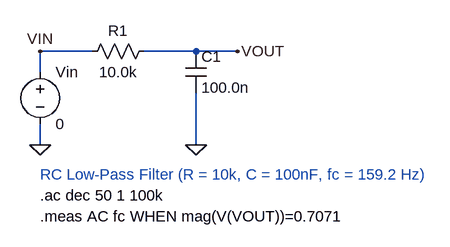
[diagram p0: schematic rc_filter.asc]
rc_filter.asc, the LTspice schematic file:
Version 4
SHEET 1 880 680
WIRE 80 160 80 192
WIRE 80 160 160 160
WIRE 80 272 80 304
WIRE 240 160 320 160
WIRE 320 160 384 160
WIRE 320 224 320 304
FLAG 80 160 VIN
FLAG 80 304 0
FLAG 384 160 VOUT
FLAG 320 304 0
SYMBOL voltage 80 176 R0
WINDOW 0 24 16 Left 2
WINDOW 3 24 96 Left 2
SYMATTR InstName Vin
SYMATTR Value 0
SYMATTR Value2 AC 1.0
SYMBOL res 256 144 R90
WINDOW 0 0 56 VBottom 2
WINDOW 3 32 56 VTop 2
SYMATTR InstName R1
SYMATTR Value 10.0k
SYMBOL cap 304 160 R0
SYMATTR InstName C1
SYMATTR Value 100.0n
TEXT 80 350 Left 2 ;RC Low-Pass Filter (R = 10k, C = 100nF, fc = 159.2 Hz)
TEXT 80 382 Left 2 !.ac dec 50 1 100k
TEXT 80 414 Left 2 !.meas AC fc WHEN mag(V(VOUT))=0.7071

The netlist it stands for:
* rc_filter.asc
Vin VIN 0 0 AC 1.0
R1 VOUT VIN 10.0k
C1 VOUT 0 100.0n
* RC Low-Pass Filter (R = 10k, C = 100nF, fc = 159.2 Hz)
.ac dec 50 1 100k
.meas AC fc WHEN mag(V(VOUT))=0.7071
.backanno
.end